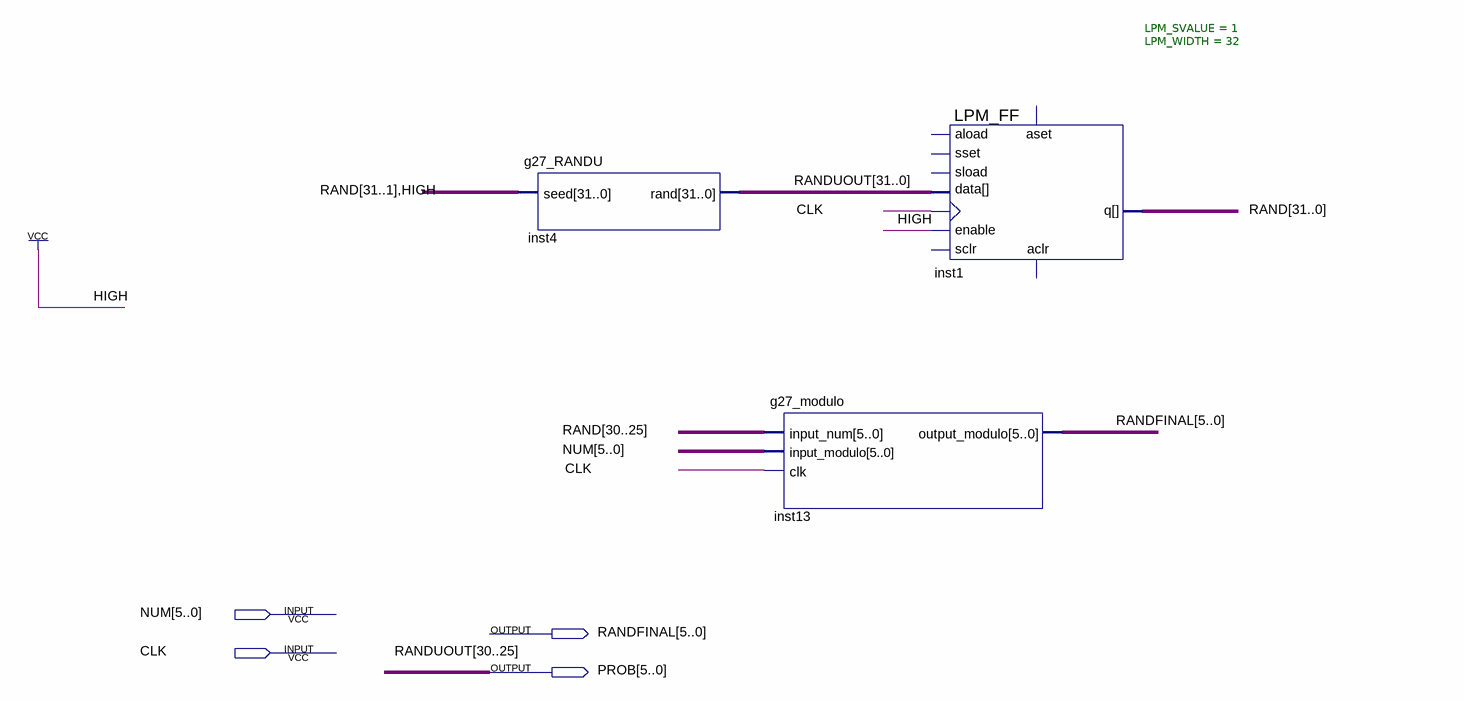
[diagram p0: schematic sheet]
// Quartus schematic rand_modulo_test.bdf as structural Verilog: 3 symbols, 4 pins
module rand_modulo_test (
  input  [5:0] NUM,
  input  CLK,
  output [5:0] RANDFINAL,
  output [5:0] PROB
);

  wire [31:0] RAND, RANDUOUT;

  g27_RANDU inst4 (.seed({RAND[31:1], 1'b1}), .\rand ({RANDUOUT[31], PROB, RANDUOUT[24:0]}));
  g27_modulo inst13 (.input_num(RAND[30:25]), .input_modulo(NUM), .clk(CLK), .output_modulo(RANDFINAL));
  LPM_FF #(.LPM_SVALUE(1), .LPM_WIDTH(32)) inst1 (
    .enable(1'b1), .clock(CLK), .data({RANDUOUT[31], PROB, RANDUOUT[24:0]}), .q(RAND));  // open: aload, sset, sload, aset, sclr, aclr

  // Other names for the same wires on the sheet: RANDUOUT[30:25] = PROB
endmodule
